# Altium schematic sheet MC60.SchDoc
size A3; SheetNumber: 6; SheetTotal: 11
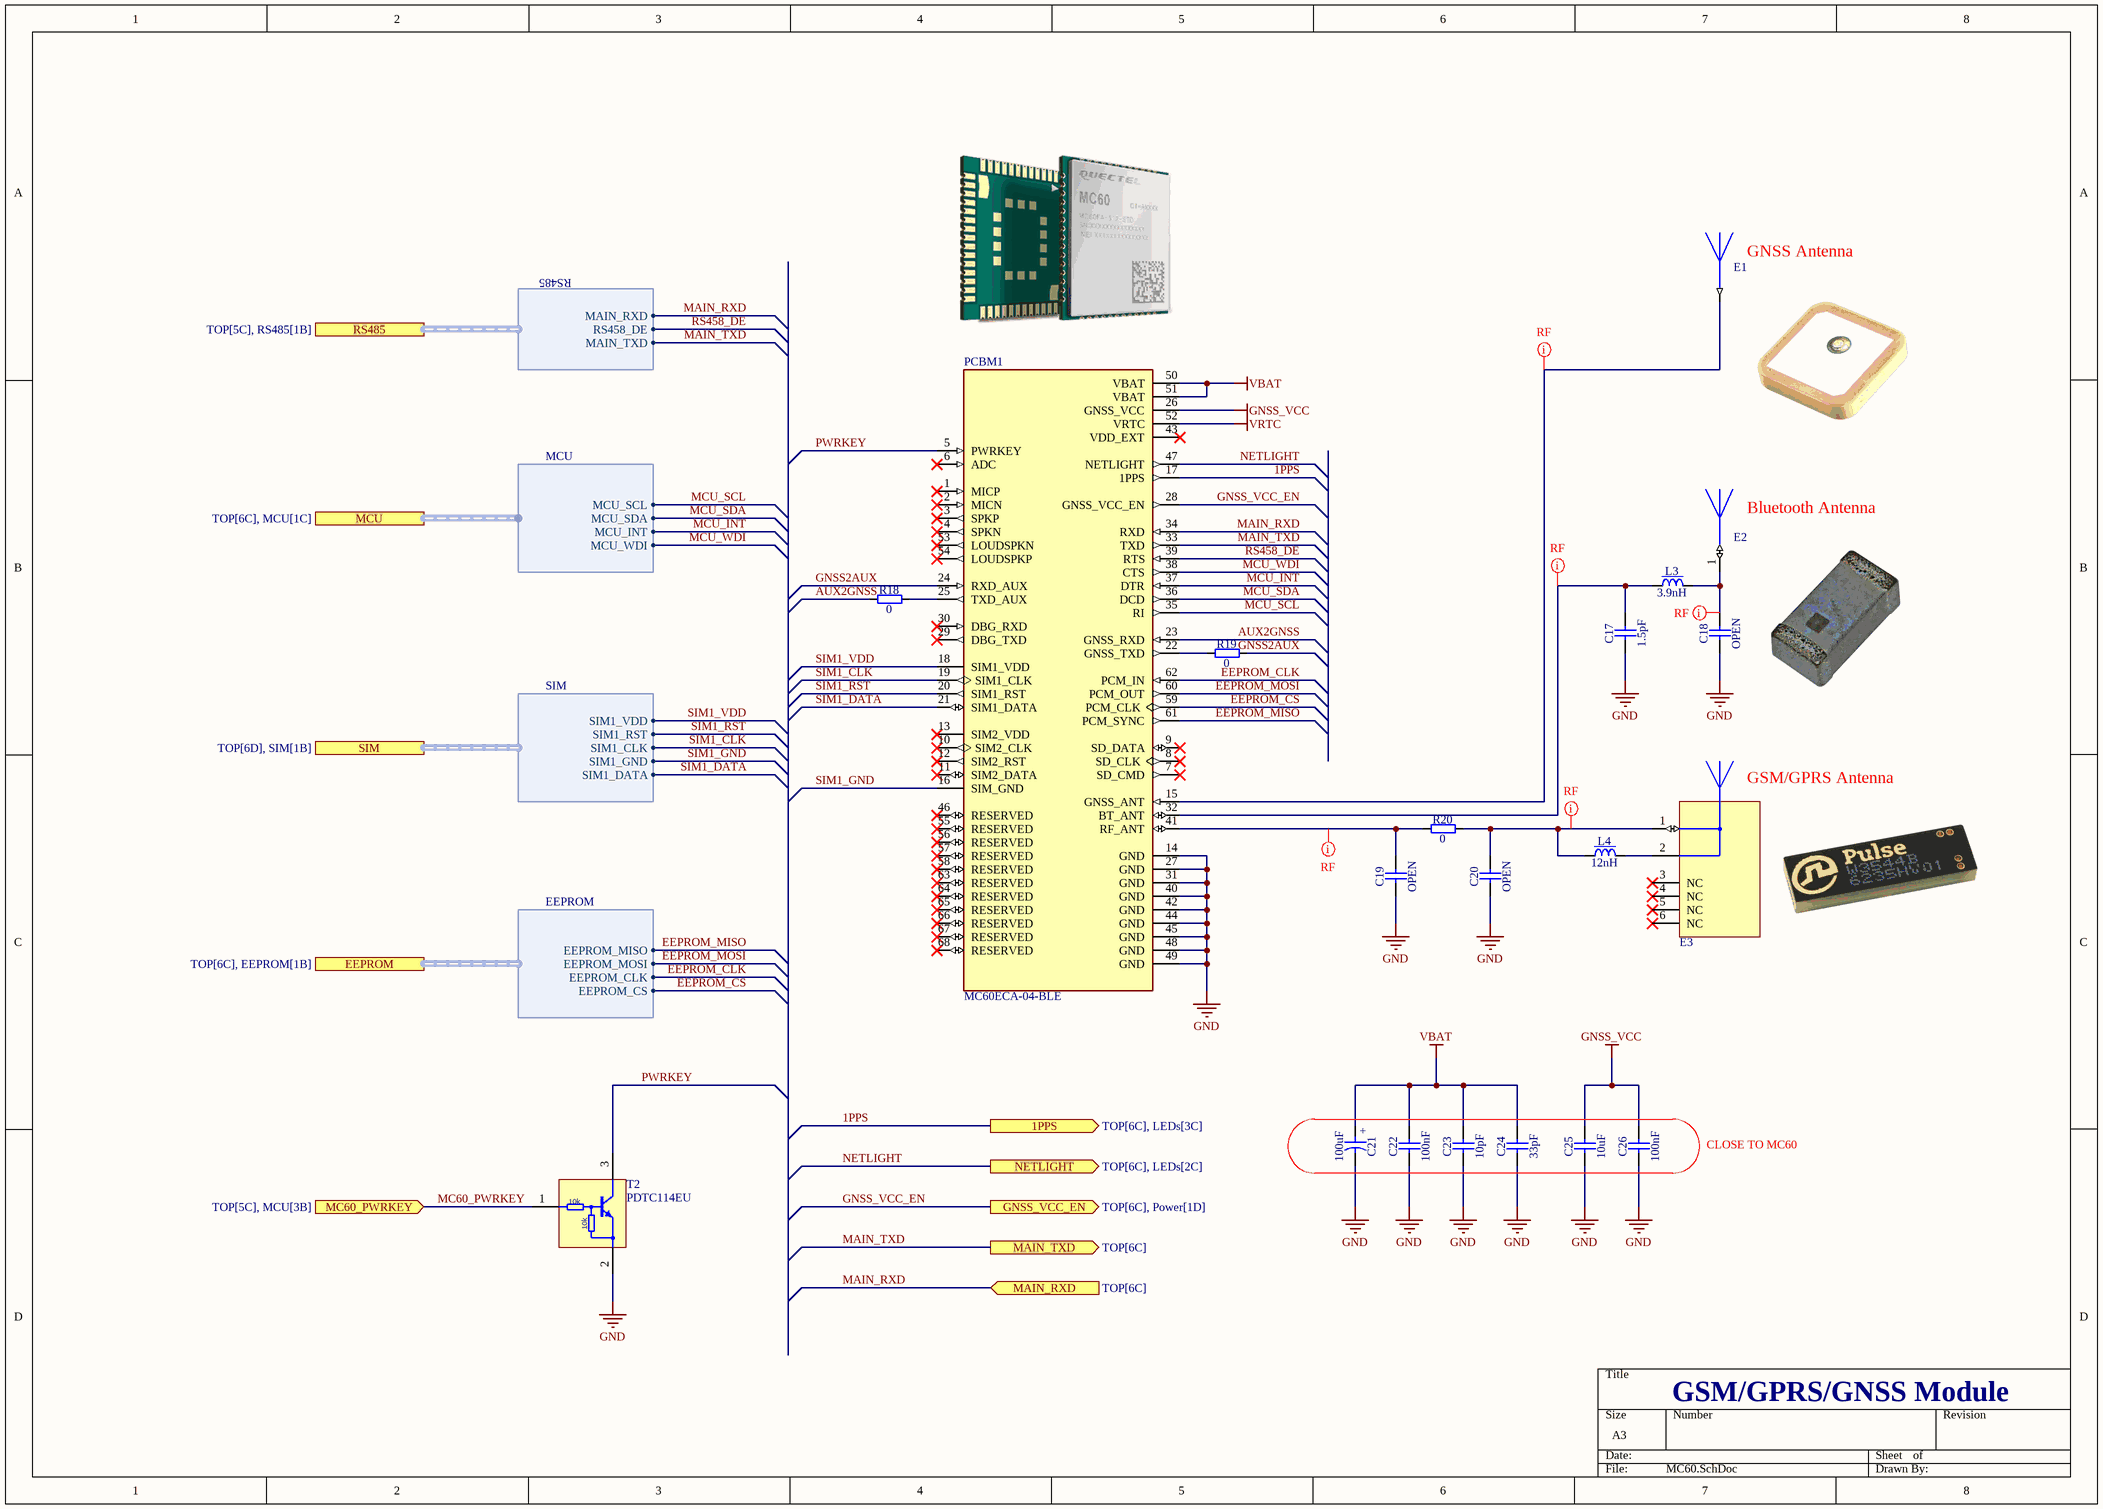
[diagram p0: MC60.SchDoc]

## Parts
C17  1.5pF  [CAPC1005X55N]
C18  OPEN  [CAPC1005X55N]
C19  OPEN  [CAPC1005X55N]
C20  OPEN  [CAPC1005X55N]
C21  100uF  [CAPMP7343X310N]
C22  100nF  [CAPC1608X87N]
C23  10pF  [CAPC1608X87N]
C24  33pF  [CAPC1608X87N]
C25  10uF  [CAPC2012X135N]
C26  100nF  [CAPC1608X87N]
E1  APAE1590R2540AKDB1-T  [GPS_GLONASS_CERAMIC_25X25]  (value not drawn)
E2  AMCA31-2R450G-S1F-T3  [AMCA31-2R450G-S1F-T3]  (value not drawn)
E3  W3544B  [PULSE_ELECTRONICS_W3544X]  (value not drawn)
L3  3.9nH  [IND_MURATA_LQW18AS_0Z]
L4  12nH  [IND_MURATA_LQW18AS_0Z]
PCBM1  MC60ECA-04-BLE  [PCBM_QUECTEL_MC60]
R18  0  [RESC1608X55N]
R19  0  [RESC1608X55N]
R20  0  [RESC1005X40N]
T2  PDTC114EU  [SOT65P210X100-3N]

## Ports
1PPS (out, see TOP[6C], LEDs[3C]), EEPROM (harness EEPROM, see TOP[6C], EEPROM[1B]), GNSS_VCC_EN (out, see TOP[6C], Power[1D]), MAIN_RXD (in, see TOP[6C]), MAIN_TXD (out, see TOP[6C]), MC60_PWRKEY (in, see TOP[5C], MCU[3B]), MCU (harness MCU, see TOP[6C], MCU[1C]), NETLIGHT (out, see TOP[6C], LEDs[2C]), RS485 (harness RS485, see TOP[5C], RS485[1B]), SIM (harness SIM, see TOP[6D], SIM[1B])

## Harnesses
EEPROM: EEPROM_MISO, EEPROM_MOSI, EEPROM_CLK, EEPROM_CS
SIM: SIM1_VDD, SIM1_RST, SIM1_CLK, SIM1_GND, SIM1_DATA
RS485: MAIN_RXD, RS458_DE, MAIN_TXD
MCU: MCU_SCL, MCU_SDA, MCU_INT, MCU_WDI

## Nets
GND: C17.1 C18.1 C19.1 C20.1 C21.2 C22.1 C23.1 C24.1 C25.1 C26.1 PCBM1.14(GND) PCBM1.27(GND) PCBM1.31(GND) PCBM1.40(GND) PCBM1.42(GND) PCBM1.44(GND) PCBM1.45(GND) PCBM1.48(GND) PCBM1.49(GND) T2.2(E)
GNSS_VCC: C25.2 C26.2 PCBM1.26(GNSS_VCC)
VBAT: C21.1 C22.2 C23.2 C24.2 PCBM1.50(VBAT) PCBM1.51(VBAT)
VRTC: PCBM1.52(VRTC)
1PPS: PCBM1.17(1PPS) ; port 1PPS
AUX2GNSS: PCBM1.23(GNSS_RXD) R18.1
EEPROM_CLK: PCBM1.62(PCM_IN) ; port EEPROM.EEPROM_CLK
EEPROM_CS: PCBM1.59(PCM_CLK) ; port EEPROM.EEPROM_CS
EEPROM_MISO: PCBM1.61(PCM_SYNC) ; port EEPROM.EEPROM_MISO
EEPROM_MOSI: PCBM1.60(PCM_OUT) ; port EEPROM.EEPROM_MOSI
GNSS2AUX: PCBM1.24(RXD_AUX) R19.2
GNSS_VCC_EN: PCBM1.28(GNSS_VCC_EN) ; port GNSS_VCC_EN
MAIN_RXD: PCBM1.34(RXD) ; port MAIN_RXD, port RS485.MAIN_RXD
MAIN_TXD: PCBM1.33(TXD) ; port MAIN_TXD, port RS485.MAIN_TXD
MC60_PWRKEY: T2.1(B) ; port MC60_PWRKEY
MCU_INT: PCBM1.37(DTR) ; port MCU.MCU_INT
MCU_SCL: PCBM1.35(RI) ; port MCU.MCU_SCL
MCU_SDA: PCBM1.36(DCD) ; port MCU.MCU_SDA
MCU_WDI: PCBM1.38(CTS) ; port MCU.MCU_WDI
NETLIGHT: PCBM1.47(NETLIGHT) ; port NETLIGHT
PWRKEY: PCBM1.5(PWRKEY) T2.3(C)
RS458_DE: PCBM1.39(RTS) ; port RS485.RS458_DE
SIM1_CLK: PCBM1.19(SIM1_CLK) ; port SIM.SIM1_CLK
SIM1_DATA: PCBM1.21(SIM1_DATA) ; port SIM.SIM1_DATA
SIM1_GND: PCBM1.16(SIM_GND) ; port SIM.SIM1_GND
SIM1_RST: PCBM1.20(SIM1_RST) ; port SIM.SIM1_RST
SIM1_VDD: PCBM1.18(SIM1_VDD) ; port SIM.SIM1_VDD
NetC17_2: C17.2 L3.1 PCBM1.32(BT_ANT)
NetC18_2: C18.2 E2.1 L3.2
NetC19_2: C19.2 PCBM1.41(RF_ANT) R20.1
NetC20_2: C20.2 E3.1 L4.1 R20.2
NetE1_1: E1.1 PCBM1.15(GNSS_ANT)
NetE3_2: E3.2 L4.2
NetPCBM1_22: PCBM1.22(GNSS_TXD) R19.1
NetPCBM1_25: PCBM1.25(TXD_AUX) R18.2

Not connected (* = marked no-connect by the designer): E3 3(NC)* 4(NC)* 5(NC)* 6(NC)*; PCBM1 1(MICP)* 2(MICN)* 3(SPKP)* 4(SPKN)* 6(ADC)* 7(SD_CMD)* 8(SD_CLK)* 9(SD_DATA)* 10(SIM2_CLK)* 11(SIM2_DATA)* 12(SIM2_RST)* 13(SIM2_VDD)* 29(DBG_TXD)* 30(DBG_RXD)* 43(VDD_EXT)* 46(RESERVED)* 53(LOUDSPKN)* 54(LOUDSPKP)* 55(RESERVED)* 56(RESERVED)* 57(RESERVED)* 58(RESERVED)* 63(RESERVED)* 64(RESERVED)* 65(RESERVED)* 66(RESERVED)* 67(RESERVED)* 68(RESERVED)*

## Layout directives
net class RF: NetC17_2, NetC18_2, NetC19_2, NetC20_2, NetE1_1

## Notes on the sheet
- (near E1) GNSS Antenna
- (near E2) Bluetooth Antenna
- GSM/GPRS Antenna
- CLOSE TO MC60
- GSM/GPRS/GNSS Module
- (in symbol CTE7343-31_100UF_10V_10%_LESR0050) +
- (in symbol PDTC114EU) 10k

## Library data of the parts
C17 = CC0402_1.5PF_50V_0.25PF_C0G: Non-polarised capacitor; Part Description: SMD Multilayer Chip Ceramic Capacitor; Manufacturer: GENERIC; Manufacturer1 Part Number: C0402C159C5GACTU; Voltage: 50V; TC: C0G/NP0; Tolerance: ±0.25pF; Part Number: CC0402_1.5PF_50V_0.25PF_C0G; Component Kind: Standard; Component Type: Standard; Pin Count: 2; Value: 1.5pF; Status: Preferred; Manufacturer Part Number: CC0402_1.5PF_50V_0.25PF_C0G; Case: 0402; Mounted: Yes; Socket: No; SMD: Yes; Sense: No; Manufacturer1 Example: KEMET; Manufacturer1 ComponentHeight: 0.55mm; HelpURL: \\cern.ch\dfs\Applications\Altium\Datasheets\CC0402_C0G_KEMET_(Commercial Grade).pdf; Author: CERN DEM JLC; CreateDate: 03.12.2007; LatestRevisionDate: 22.04.2015
C18-C20 = CC0402_0.2PF_50V_0.05PF_C0G_KEMET_HiQ-CBR: Non-polarised capacitor; Part Description: High Q and low ESR, SMD Multilayer Chip Ceramic Capacitor, HiQ-CBR Series; Value: 0.2pF; Voltage: 50V; TC: C0G/NP0; Tolerance: ±0.05pF; Part Number: CC0402_0.2PF_50V_0.05PF_C0G_KEMET_HiQ-CBR; Component Kind: Standard; Component Type: Standard; Pin Count: 2; Status: Not Recommended; Manufacturer: OPEN; Manufacturer Part Number: OPEN; Case: 0402; Mounted: Yes; Socket: No; SMD: Yes; Sense: No; ComponentHeight: 0.55mm; HelpURL: \\cern.ch\dfs\Applications\Altium\Datasheets\CC0402_C0G_KEMET_HiQ-CBR.pdf; Author: CERN DEM JLC; CreateDate: 09.03.2017; LatestRevisionDate: 21.11.2017
C21 = CTE7343-31_100UF_10V_10%_LESR0050: Polarised capacitor; Part Description: Low ESR 0R050 Solid Tantalum Chip Capacitor; Manufacturer: GENERIC; Manufacturer1 Part Number: TPSD107K010R0050; Voltage: 10V; Tolerance: ±10%; Part Number: CTE7343-31_100UF_10V_10%_LESR0050; Component Kind: Standard; Component Type: Standard; Pin Count: 2; Value: 100uF; Status: Preferred; Manufacturer Part Number: CTE7343-31_100UF_10V_10%_LESR0050; Case: D; Mounted: Yes; Socket: No; SMD: Yes; Sense: No; Manufacturer1 Example: AVX; Manufacturer1 ComponentHeight: 3.1mm; HelpURL: \\cern.ch\dfs\Applications\Altium\Datasheets\CTE-LESR_AVX_TPS.pdf; Author: CERN DEM JLC; CreateDate: 05.05.2008; LatestRevisionDate: 20.01.2009
C22 C26 = CC0603_100NF_50V_10%_X7R: Non-polarised capacitor; Part Description: SMD Multilayer Chip Ceramic Capacitor; Manufacturer: GENERIC; Manufacturer1 Part Number: 223858615649; Voltage: 50V; TC: X7R; Tolerance: ±10%; Part Number: CC0603_100NF_50V_10%_X7R; Component Kind: Standard; Component Type: Standard; Pin Count: 2; Value: 100nF; Status: Preferred; Manufacturer Part Number: CC0603_100NF_50V_10%_X7R; Case: 0603; Mounted: Yes; Socket: No; SMD: Yes; Sense: No; Manufacturer1 Example: PHYCOMP; Manufacturer1 ComponentHeight: 0.87mm; HelpURL: \\cern.ch\dfs\Applications\Altium\Datasheets\CC0603_X7R_PHYCOMP.pdf; Author: CERN DEM JLC; CreateDate: 03.12.2007; LatestRevisionDate: 03.12.2007
C23 = CC0603_10PF_50V_5%_NP0: Non-polarised capacitor; Part Description: SMD Multilayer Chip Ceramic Capacitor; Manufacturer: GENERIC; Manufacturer1 Part Number: 223886715109; Voltage: 50V; TC: C0G/NP0; Tolerance: ±5%; Part Number: CC0603_10PF_50V_5%_NP0; Component Kind: Standard; Component Type: Standard; Pin Count: 2; Value: 10pF; Status: Preferred; Manufacturer Part Number: CC0603_10PF_50V_5%_NP0; Case: 0603; Mounted: Yes; Socket: No; SMD: Yes; Sense: No; Manufacturer1 Example: PHYCOMP; Manufacturer1 ComponentHeight: 0.87mm; HelpURL: \\cern.ch\dfs\Applications\Altium\Datasheets\CC0603_NP0_PHYCOMP.pdf; Author: CERN DEM JLC; CreateDate: 03.12.2007; LatestRevisionDate: 03.12.2007
C24 = CC0603_33PF_50V_5%_NP0: Non-polarised capacitor; Part Description: SMD Multilayer Chip Ceramic Capacitor; Manufacturer: GENERIC; Manufacturer1 Part Number: 223886715339; Voltage: 50V; TC: C0G/NP0; Tolerance: ±5%; Part Number: CC0603_33PF_50V_5%_NP0; Component Kind: Standard; Component Type: Standard; Pin Count: 2; Value: 33pF; Status: Preferred; Manufacturer Part Number: CC0603_33PF_50V_5%_NP0; Case: 0603; Mounted: Yes; Socket: No; SMD: Yes; Sense: No; Manufacturer1 Example: PHYCOMP; Manufacturer1 ComponentHeight: 0.87mm; HelpURL: \\cern.ch\dfs\Applications\Altium\Datasheets\CC0603_NP0_PHYCOMP.pdf; Author: CERN DEM JLC; CreateDate: 03.12.2007; LatestRevisionDate: 03.12.2007
C25 = CC0805_10UF_10V_10%_X7R: Non-polarised capacitor; Part Description: SMD Multilayer Chip Ceramic Capacitor; Manufacturer: GENERIC; Manufacturer1 Part Number: GRM21BR71A106KE51L; Voltage: 10V; TC: X7R; Tolerance: ±10%; Part Number: CC0805_10UF_10V_10%_X7R; Component Kind: Standard; Component Type: Standard; Pin Count: 2; Value: 10uF; Status: Preferred; Manufacturer Part Number: CC0805_10UF_10V_10%_X7R; Case: 0805; Mounted: Yes; Socket: No; SMD: Yes; Sense: No; Manufacturer1 Example: MURATA; Manufacturer1 ComponentHeight: 1.35mm; HelpURL: \\cern.ch\dfs\Applications\Altium\Datasheets\CC0805_X7R_MURATA.pdf; Author: CERN DEM JLC; CreateDate: 30.04.2012; LatestRevisionDate: 30.04.2012
E1 = ABRACON_APAE1590R2540AKDB1-T: 1.575GHz, 1.602GHz GLONASS, GPS Ceramic Patch RF Antenna 1.575GHz ~ 1.608GHz Pin Adhesive; MF: Abracon LLC; Check_prices: https://www.snapeda.com/parts/APAE1590R2540AKDB1-T/Abracon+LLC/view-part/?ref=eda; Purchase-URL: https://pricing.snapeda.com/search/part/APAE1590R2540AKDB1-T/?ref=eda; Value: *; Availability: In Stock; Package: None; SnapEDA_Link: https://www.snapeda.com/parts/APAE1590R2540AKDB1-T/Abracon+LLC/view-part/?ref=snap; MP: APAE1590R2540AKDB1-T; Price: None; Part Number: ABRACON_APAE1590R2540AKDB1-T; Device: APAE1590R2540AKDB1-T; Footprint: GPS-GLONASS ANT 25.0mm x 25mm; Pin Count: 1; PackageDescription: GPS-GLONASS ANT 25.0mm x 25mm; Family: APAE; Mounted: Yes; Socket: No; SMD: No; Sense: No; Status: None; Part Description: 1.575GHz, 1.602GHz GLONASS, GPS Ceramic Patch RF Antenna 1.575GHz ~ 1.608GHz Pin Adhesive; Manufacturer: Abracon LLC; Manufacturer Part Number: APAE1590R2540AKDB1-T; HelpURL: https://abracon.com/patchantenna/APAE1590R2540AKDB1-T.pdf; Author: Xusniyor; CreateDate: 21.04.2023; LatestRevisionDate: 21.04.2023
E2 = AMCA31-2R450G-S1F-T3: 2.4GHz Bluetooth, Wi-Fi, WLAN Chip RF Antenna 2.405GHz ~ 2.495GHz 0.5dBi Solder Surface Mount; MF: Abracon LLC; Check_prices: https://www.snapeda.com/parts/AMCA31-2R450G-S1F-T3/Abracon+LLC/view-part/?ref=eda; Purchase-URL: https://pricing.snapeda.com/search/part/AMCA31-2R450G-S1F-T3/?ref=eda; Value: *; Availability: In Stock; Package: None; SnapEDA_Link: https://www.snapeda.com/parts/AMCA31-2R450G-S1F-T3/Abracon+LLC/view-part/?ref=snap; MP: AMCA31-2R450G-S1F-T3; Price: None; Part Number: AMCA31-2R450G-S1F-T3; Device: AMCA31-2R450G-S1F-T3; Footprint: RF ANT 2.4GHZ CHIP SOLDER SMD; Pin Count: 2; PackageDescription: RF ANT 2.4GHZ CHIP SOLDER SMD; Family: AMCA; Mounted: Yes; Socket: No; SMD: Yes; Sense: No; Status: None; Part Description: 2.4GHz Bluetooth, Wi-Fi, WLAN Chip RF Antenna 2.405GHz ~ 2.495GHz 0.5dBi Solder Surface Mount; Manufacturer: Abracon LLC; Manufacturer Part Number: AMCA31-2R450G-S1F-T3; HelpURL: https://abracon.com/chip-antenna/AMCA31-2R450G-S1F-T3.pdf; Author: Xusniyor; CreateDate: 22.04.2023; LatestRevisionDate: 22.04.2023
E3 = PULSE_ELECTRONICS_W3544X: 850MHz, 900MHz, 1.8GHz, 1.9GHz, 2.1GHz GSM Chip RF Antenna 824MHz ~ 960MHz, 1.71GHz ~ 2.17GHz -1.5dBi, -1.1dBi, -1.1dBi, -1.5dBi Solder Surface Mount; Manufacturer: Pulse Electronics; Part Number: PULSE_ELECTRONICS_W3544X; Device: W3544B; Footprint: RF ANT 850MHZ/900MHZ CHIP SLD 26.00mm x 7.65mm; Pin Count: 6; PackageDescription: RF ANT 850MHZ/900MHZ CHIP SLD 26.00mm x 7.65mm; Family: None; Mounted: Yes; Socket: No; SMD: Yes; Sense: No; Status: None; Part Description: 850MHz, 900MHz, 1.8GHz, 1.9GHz, 2.1GHz GSM Chip RF Antenna 824MHz ~ 960MHz, 1.71GHz ~ 2.17GHz -1.5dBi, -1.1dBi, -1.1dBi, -1.5dBi Solder Surface Mount; Manufacturer Part Number: W3544B; HelpURL: https://productfinder.pulseelectronics.com/api/open/part-attachments/datasheet/W3544B; Author: Xusniyor; CreateDate: 20.04.2023; LatestRevisionDate: 20.04.2023
L3 = IND0603_12NH_5%_MURATA_LQW18AN3N9D00D: Inductor With Core; Part Description: 3.9 nH Unshielded Wirewound Inductor 850 mA 59mOhm Max 0603 (1608 Metric); Manufacturer: MURATA; Power: 850mA; Resistance: 0.059R; Tolerance: ±5%; Part Number: IND0603_12NH_5%_MURATA_LQW18AN3N9D00D; Component Kind: Standard; Component Type: Standard; Pin Count: 2; Value: 3.9nH; Manufacturer Part Number: LQW18AN3N9D00D; Case: 0603; Mounted: Yes; Socket: No; SMD: Yes; Sense: No; ComponentHeight: 1mm; HelpURL: https://search.murata.co.jp/Ceramy/image/img/P02/JELF243A-0024.pdf; Author: Xusniyor; CreateDate: 22.04.2023; LatestRevisionDate: 22.04.2023
L4 = IND0603_12NH_5%_MURATA_LQW18AN12NJ00D: Inductor With Core; Part Description: 12 nH Unshielded Wirewound Inductor 600 mA 130mOhm Max 0603 (1608 Metric); Manufacturer: MURATA; Power: 600mA; Resistance: 0.130R; Tolerance: ±5%; Part Number: IND0603_12NH_5%_MURATA_LQW18AN12NJ00D; Component Kind: Standard; Component Type: Standard; Pin Count: 2; Value: 12nH; Manufacturer Part Number: LQW18AN12NJ00D; Case: 0603; Mounted: Yes; Socket: No; SMD: Yes; Sense: No; ComponentHeight: 1mm; HelpURL: https://search.murata.co.jp/Ceramy/image/img/P02/JELF243A-0024.pdf; Author: Xusniyor; CreateDate: 21.04.2023; LatestRevisionDate: 21.04.2023
PCBM1 = MC60ECA-04-BLE: MC60 is a quad-band full-featured GSM/GPRS module using LCC castellation package. With an extensive set of Internet protocols (TCP, UDP, PPP, FTP, HTTP and SSL), it has integrated the GNSS technology for satellite navigation; Part Description: Cellular, Navigation BeiDou, Galileo, GLONASS, GPS, GNSS, GSM, GPRS Transceiver Module 850MHz, 900MHz, 1.561GHz, 1.575GHz, 1.602GHz, 1.8GHz, 1.9GHz Antenna Not Included Surface Mount; MF: Quectel; PressFit: No; Bonding: No; Purchase-URL: https://pricing.snapeda.com/search/part/MC60ECA-04-BLE/?ref=eda; Check_prices: https://www.snapeda.com/parts/MC60ECA-04-BLE/Quectel/view-part/?ref=eda; Availability: In Stock; Value: *; MP: MC60ECA-04-BLE; Price: None; Package: Custom Quectel; SnapEDA_Link: https://www.snapeda.com/parts/MC60ECA-04-BLE/Quectel/view-part/?ref=snap; Part Number: MC60ECA-04-BLE; Component Kind: Standard; Component Type: Standard; Device: MC60ECA-04-BLE; PackageDescription: Quectel MC60 GSM/GPRS/GNSS Module 18.7mm x 16.0mm; Manufacturer: Quectel; Manufacturer Part Number: MC60ECA-04-BLE; Pin Count: 68; Mounted: Yes; Socket: No; SMD: Yes; Sense: No; ComponentHeight: 2.1mm; Author: Xusniyor; HelpURL: https://eu.mouser.com/datasheet/2/1052/Quectel_MC60_GSM_Combo_Specification_V1_3-1830362.pdf; ComponentLink1URL: https://www.quectel.com/download/quectel_mc60_hardware_design_v2-1; ComponentLink1Description: Design Guide; CreateDate: 20.04.2023; LatestRevisionDate: 20.04.2023
R18 R19 = R0603_0R_JUMPER: Resistor; Part Description: 1A (0.05R Max DC Resistance) Zero Ohm Jumper; Manufacturer: GENERIC; Manufacturer1 Part Number: NRC06Z0; PressFit: No; Part Number: R0603_0R_JUMPER; Component Kind: Standard; Component Type: Standard; Pin Count: 2; Value: 0; Status: Preferred; Manufacturer Part Number: R0603_0R_JUMPER; Case: 0603; Mounted: Yes; Sense: No; Socket: No; SMD: Yes; Manufacturer1 Example: NIC COMPONENT; Manufacturer1 ComponentHeight: 0.55mm; HelpURL: \\cern.ch\dfs\Applications\Altium\Datasheets\R0603_NIC_NRC.pdf; Author: CERN DEM JLC; CreateDate: 03.12.2007; LatestRevisionDate: 13.03.2008
R20 = R0402_0R_JUMPER: Resistor; Part Description: 1A (0.05R Max DC Resistance) Zero Ohm Jumper; Manufacturer: GENERIC; Manufacturer1 Part Number: 232270591001L; PressFit: No; Part Number: R0402_0R_JUMPER; Component Kind: Standard; Component Type: Standard; Pin Count: 2; Value: 0; Status: Not Recommended; Manufacturer Part Number: R0402_0R_JUMPER; Case: 0402; Mounted: Yes; Sense: No; Socket: No; SMD: Yes; Manufacturer1 Example: YAGEO PHYCOMP; Manufacturer1 ComponentHeight: 0.4mm; HelpURL: \\cern.ch\dfs\Applications\Altium\Datasheets\R0402_Phycomp_RC0402.pdf; Author: CERN DEM JLC; CreateDate: 03.12.2007; LatestRevisionDate: 17.10.2012
T2 = PDTC114EU: Pre-Biased Bipolar Transistor (BJT) NPN - Pre-Biased 50 V 100 mA 200 mW Surface Mount SOT-323; Manufacturer: Nexperia USA Inc.; PressFit: No; Bonding: No; Part Number: PDTC114EU; Component Kind: Standard; Component Type: Standard; Device: PDTC114EU; PackageDescription: SOT323, 0.65mm pitch; 3 pin, 1.25mm W X 2.00mm L, IPC Medium Density; Part Description: Pre-Biased Bipolar Transistor (BJT) NPN - Pre-Biased 50 V 100 mA 200 mW Surface Mount SOT-323; Manufacturer Part Number: PDTC114EU; Pin Count: 3; Case: SOT-323; Mounted: Yes; Socket: No; SMD: Yes; Sense: No; ComponentHeight: 0.8mm; HelpURL: https://assets.nexperia.com/documents/data-sheet/PDTC114E_SER.pdf; Author: Xusniyor; CreateDate: 22.04.2023; LatestRevisionDate: 22.04.2023